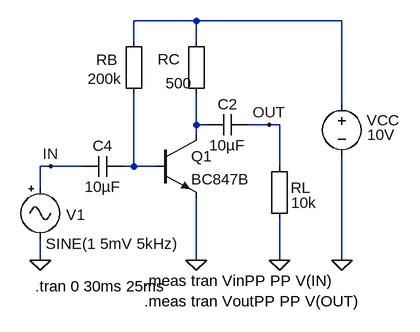
[diagram p0: schematic BT-CE-AMP-3.asc]
BT-CE-AMP-3.asc, the LTspice schematic file:
Version 4
SHEET 1 880 680
WIRE 192 -64 96 -64
WIRE 416 -64 192 -64
WIRE 96 -32 96 -64
WIRE 192 -32 192 -64
WIRE 416 64 416 -64
WIRE 192 96 192 48
WIRE 208 96 192 96
WIRE 304 96 272 96
WIRE 320 96 304 96
WIRE 192 112 192 96
WIRE -32 160 -48 160
WIRE 16 160 -32 160
WIRE 96 160 96 48
WIRE 96 160 80 160
WIRE 128 160 96 160
WIRE 320 160 320 96
WIRE -48 192 -48 160
WIRE -48 304 -48 272
WIRE 192 304 192 208
WIRE 320 304 320 240
WIRE 416 304 416 144
FLAG 192 304 0
FLAG -48 304 0
FLAG 416 304 0
FLAG -32 160 IN
FLAG 304 96 OUT
FLAG 320 304 0
SYMBOL npn 128 112 R0
SYMATTR InstName Q1
SYMATTR Value BC847B
SYMBOL Misc\\EuropeanResistor 80 -48 R0
WINDOW 0 -42 44 Left 2
WINDOW 3 -55 73 Left 2
SYMATTR InstName RB
SYMATTR Value 200k
SYMBOL Misc\\EuropeanResistor 176 -48 R0
WINDOW 0 -43 43 Left 2
WINDOW 3 -31 80 Left 2
SYMATTR InstName RC
SYMATTR Value 500
SYMBOL Misc\\signal -48 176 R0
WINDOW 123 0 0 Left 2
WINDOW 0 40 58 Left 2
WINDOW 3 8 103 Left 2
SYMATTR InstName V1
SYMATTR Value SINE(1 5mV 5kHz)
SYMBOL voltage 416 48 R0
WINDOW 0 38 41 Left 2
WINDOW 3 39 63 Left 2
WINDOW 123 0 0 Left 2
WINDOW 39 0 0 Left 2
SYMATTR InstName VCC
SYMATTR Value 10V
SYMBOL cap 80 144 R90
WINDOW 0 0 32 VBottom 2
WINDOW 3 32 32 VTop 2
SYMATTR InstName C4
SYMATTR Value 10µF
SYMBOL cap 272 80 R90
WINDOW 0 0 32 VBottom 2
WINDOW 3 32 32 VTop 2
SYMATTR InstName C2
SYMATTR Value 10µF
SYMBOL Misc\\EuropeanResistor 304 144 R0
WINDOW 0 33 49 Left 2
WINDOW 3 34 72 Left 2
SYMATTR InstName RL
SYMATTR Value 10k
TEXT -56 344 Left 2 !.tran 0 30ms 25ms
TEXT 112 336 Left 2 !.meas tran VinPP PP V(IN)\n.meas tran VoutPP PP V(OUT)

The netlist it stands for:
* BT-CE-AMP-3.asc
Q1 N002 N003 0 0 BC847B
RB N001 N003 200k
RC N001 N002 500
V1 IN 0 SINE(1 5mV 5kHz)
VCC N001 0 10V
C4 N003 IN 10µF
C2 OUT N002 10µF
RL OUT 0 10k
.model NPN NPN
.model PNP PNP
.lib standard.bjt
.tran 0 30ms 25ms
.meas tran VinPP PP V(IN)
.meas tran VoutPP PP V(OUT)
.backanno
.end